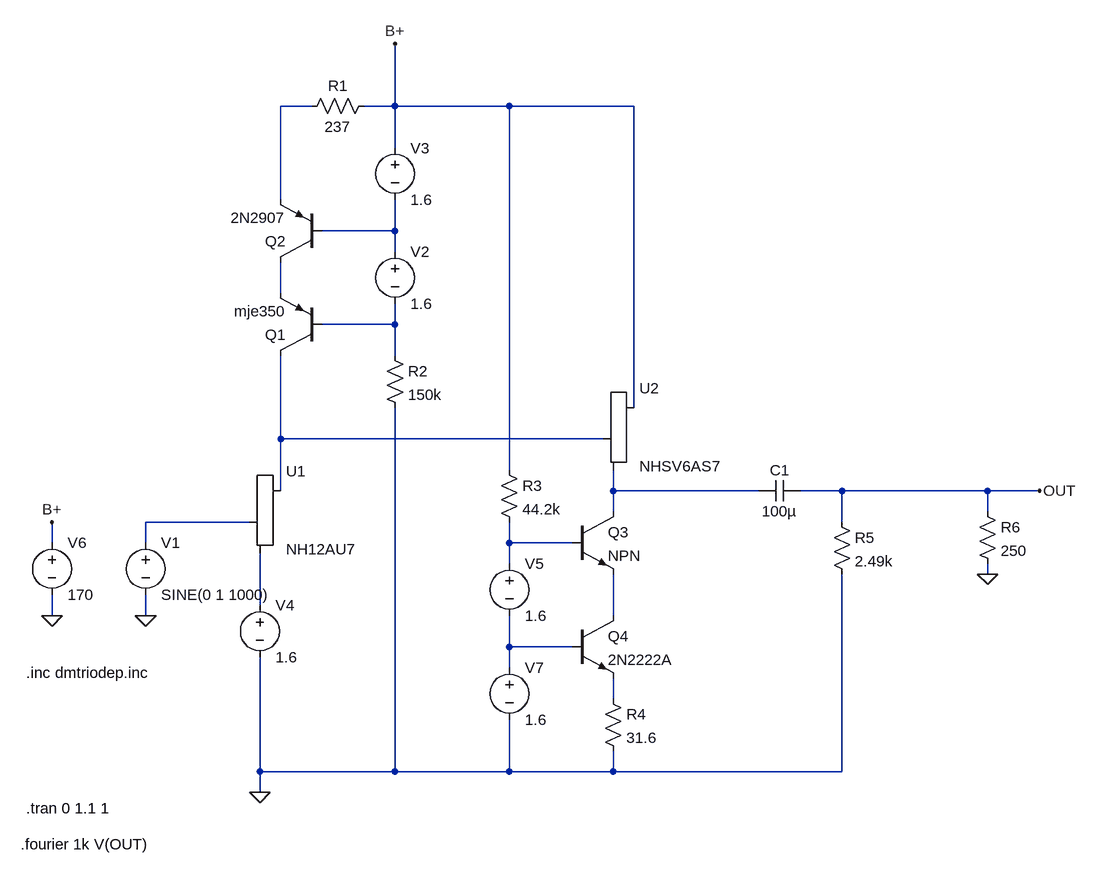
[diagram p0: schematic crack_spice.asc]
crack_spice.asc, the LTspice schematic file:
Version 4
SHEET 1 1524 680
WIRE 336 -560 288 -560
WIRE 464 -560 464 -656
WIRE 464 -560 416 -560
WIRE 640 -560 464 -560
WIRE 832 -560 640 -560
WIRE 464 -496 464 -560
WIRE 288 -416 288 -560
WIRE 464 -368 464 -416
WIRE 464 -368 352 -368
WIRE 464 -336 464 -368
WIRE 288 -272 288 -320
WIRE 464 -224 464 -256
WIRE 464 -224 352 -224
WIRE 464 -176 464 -224
WIRE 832 -96 832 -560
WIRE 288 -48 288 -176
WIRE 784 -48 288 -48
WIRE 640 0 640 -560
WIRE 288 32 288 -48
WIRE 800 32 800 0
WIRE 1024 32 800 32
WIRE 1152 32 1088 32
WIRE 1376 32 1152 32
WIRE 1456 32 1376 32
WIRE 800 64 800 32
WIRE 1376 64 1376 32
WIRE 240 80 80 80
WIRE 1152 80 1152 32
WIRE -64 112 -64 80
WIRE 80 112 80 80
WIRE 640 112 640 80
WIRE 736 112 640 112
WIRE 640 144 640 112
WIRE 1376 160 1376 144
WIRE 256 208 256 128
WIRE -64 224 -64 192
WIRE 80 224 80 192
WIRE 800 224 800 160
WIRE 640 272 640 224
WIRE 736 272 640 272
WIRE 640 304 640 272
WIRE 800 352 800 320
WIRE 256 464 256 288
WIRE 464 464 464 -96
WIRE 464 464 256 464
WIRE 640 464 640 384
WIRE 640 464 464 464
WIRE 800 464 800 432
WIRE 800 464 640 464
WIRE 1152 464 1152 160
WIRE 1152 464 800 464
WIRE 256 496 256 464
FLAG 80 224 0
FLAG 464 -656 B+
FLAG 256 496 0
FLAG 1456 32 OUT
FLAG -64 224 0
FLAG -64 80 B+
FLAG 1376 160 0
SYMBOL voltage 80 96 R0
WINDOW 123 0 0 Left 0
WINDOW 39 0 0 Left 0
SYMATTR InstName V1
SYMATTR Value SINE(0 1 1000)
SYMBOL Misc\\triode 288 80 R0
SYMATTR InstName U1
SYMATTR Value NH12AU7
SYMBOL pnp 352 -176 R180
SYMATTR InstName Q1
SYMATTR Value mje350
SYMBOL voltage 464 -352 R0
WINDOW 123 0 0 Left 0
WINDOW 39 0 0 Left 0
SYMATTR InstName V2
SYMATTR Value 1.6
SYMBOL pnp 352 -320 R180
SYMATTR InstName Q2
SYMATTR Value 2N2907
SYMBOL voltage 464 -512 R0
WINDOW 0 24 17 Left 2
WINDOW 123 0 0 Left 0
WINDOW 39 0 0 Left 0
SYMATTR InstName V3
SYMATTR Value 1.6
SYMBOL res 432 -576 R90
WINDOW 0 0 56 VBottom 2
WINDOW 3 32 56 VTop 2
SYMATTR InstName R1
SYMATTR Value 237
SYMBOL res 448 -192 R0
SYMATTR InstName R2
SYMATTR Value 150k
SYMBOL voltage 256 192 R0
WINDOW 123 0 0 Left 0
WINDOW 39 0 0 Left 0
SYMATTR InstName V4
SYMATTR Value 1.6
SYMBOL Misc\\triode 832 -48 R0
SYMATTR InstName U2
SYMATTR Value NHSV6AS7
SYMBOL res 624 -16 R0
SYMATTR InstName R3
SYMATTR Value 44.2k
SYMBOL npn 736 64 R0
SYMATTR InstName Q3
SYMBOL voltage 640 128 R0
WINDOW 123 0 0 Left 0
WINDOW 39 0 0 Left 0
SYMATTR InstName V5
SYMATTR Value 1.6
SYMBOL npn 736 224 R0
SYMATTR InstName Q4
SYMATTR Value 2N2222A
SYMBOL res 784 336 R0
SYMATTR InstName R4
SYMATTR Value 31.6
SYMBOL cap 1088 16 R90
WINDOW 0 0 32 VBottom 2
WINDOW 3 32 32 VTop 2
SYMATTR InstName C1
SYMATTR Value 100µ
SYMBOL res 1136 64 R0
SYMATTR InstName R5
SYMATTR Value 2.49k
SYMBOL voltage -64 96 R0
WINDOW 123 0 0 Left 0
WINDOW 39 0 0 Left 0
SYMATTR InstName V6
SYMATTR Value 170
SYMBOL voltage 640 288 R0
WINDOW 123 0 0 Left 0
WINDOW 39 0 0 Left 0
SYMATTR InstName V7
SYMATTR Value 1.6
SYMBOL res 1360 48 R0
SYMATTR InstName R6
SYMATTR Value 250
TEXT -104 312 Left 2 !.inc dmtriodep.inc
TEXT -104 520 Left 2 !.tran 0 1.1 1
TEXT -112 576 Left 2 !.fourier 1k V(OUT)

The netlist it stands for:
* crack_spice.asc
V1 N007 0 SINE(0 1 1000)
XU1 N005 N007 N009 NH12AU7
Q1 N005 N004 N003 0 mje350
V2 N002 N004 1.6
Q2 N003 N002 N001 0 2N2907
V3 B+ N002 1.6
R1 B+ N001 237
R2 N004 0 150k
V4 N009 0 1.6
XU2 B+ N005 N006 NHSV6AS7
R3 B+ N008 44.2k
Q3 N006 N008 N010 0 NPN
V5 N008 N011 1.6
Q4 N010 N011 N012 0 2N2222A
R4 N012 0 31.6
C1 OUT N006 100µ
R5 OUT 0 2.49k
V6 B+ 0 170
V7 N011 0 1.6
R6 OUT 0 250
.model NPN NPN
.model PNP PNP
.lib standard.bjt
.inc dmtriodep.inc
.tran 0 1.1 1
.fourier 1k V(OUT)
.backanno
.end